# EAGLE design Power-board-new-version (EAGLE 9.1.0)
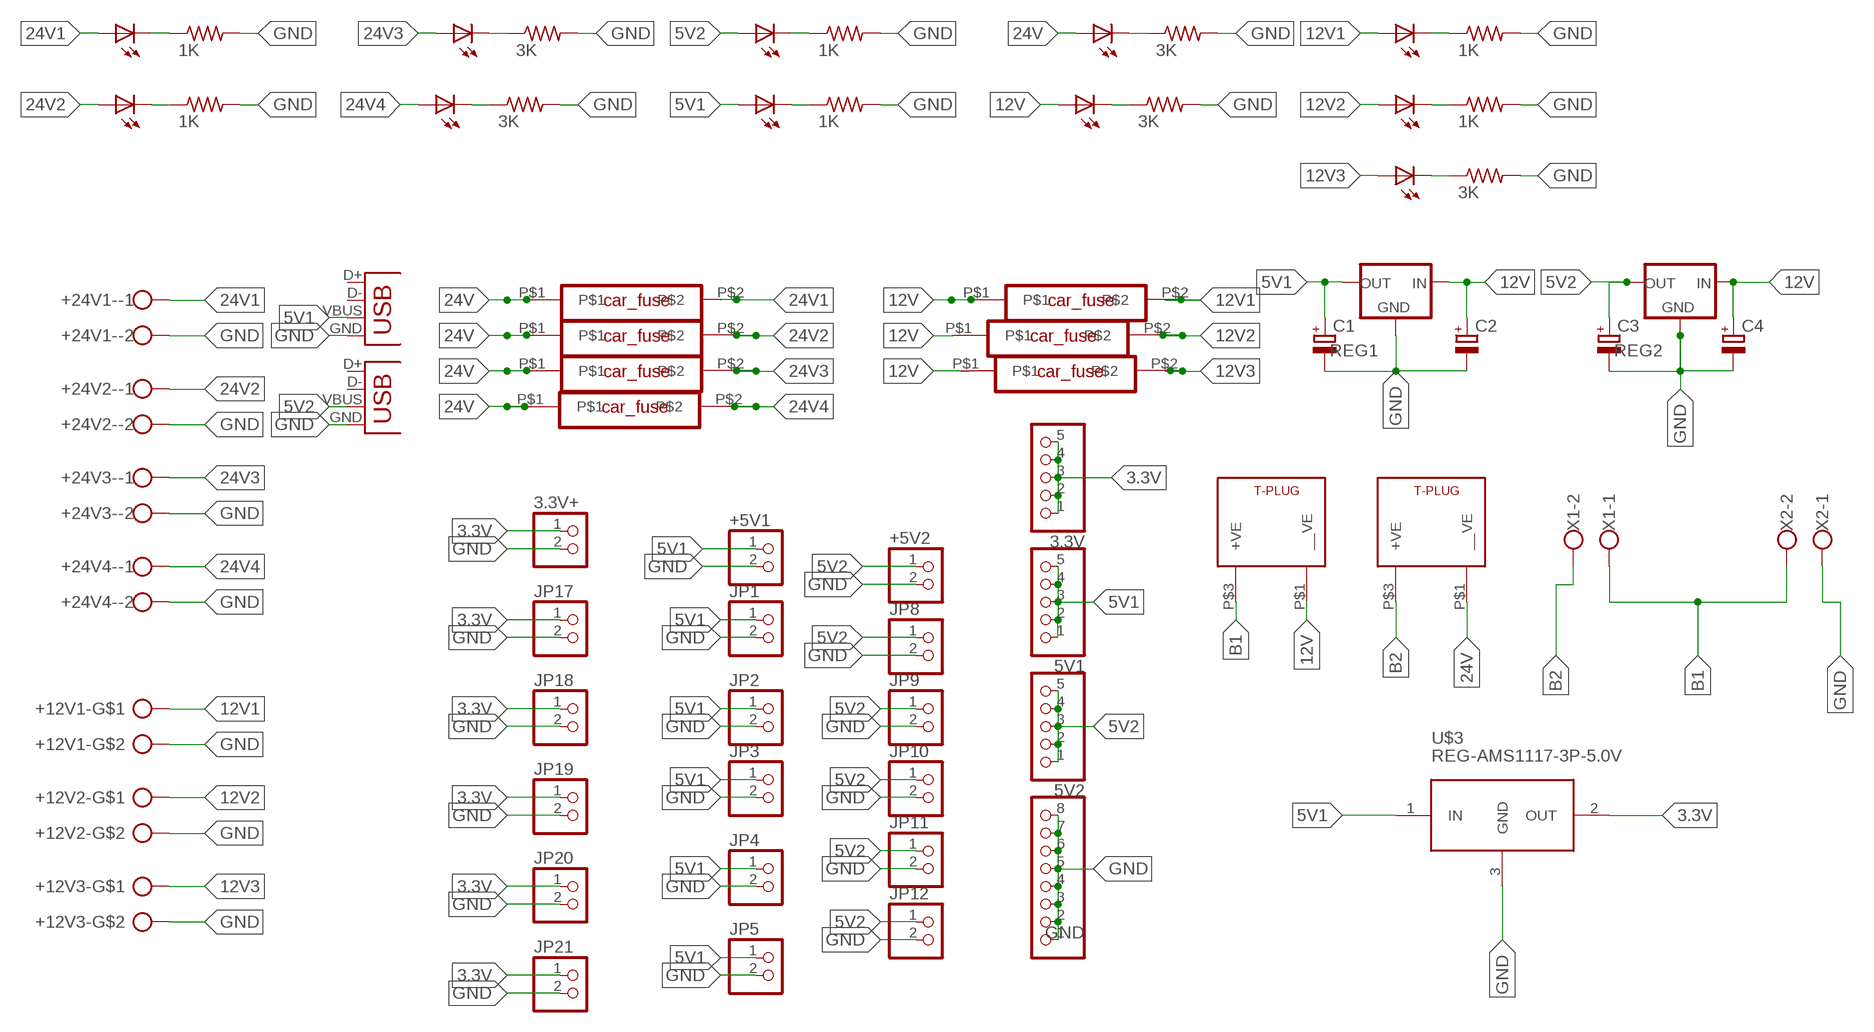
[diagram p0: schematic, sheet 1]

## Parts
1K  1K  RES-7  [0204/7]
1K1  1K  RES-7  [0204/7]
1K2  1K  RES-7  [0204/7]
3.3V  PINHD-1X5  [1X05]
3.3V+  PINHD-2_DATA  [1X02_DATA]
5V1  PINHD-1X5  [1X05]
5V2  PINHD-1X5  [1X05]
+5V1  PINHD-2_DATA  [1X02_DATA]
+5V2  PINHD-2_DATA  [1X02_DATA]
+12V1-  CON_PTR_2  [AK300/2]
+12V2-  CON_PTR_2  [AK300/2]
+12V3-  CON_PTR_2  [AK300/2]
+24V1-  ROSTA.POWER  [W239-302]
+24V2-  ROSTA.POWER  [W239-302]
+24V3-  ROSTA.POWER  [W239-302]
+24V4-  ROSTA.POWER  [W239-302]
C1  CAP_POL  [E3,5-8]
C2  CAP_POL  [E3,5-8]
C3  CAP_POL  [E3,5-8]
C4  CAP_POL  [E3,5-8]
GND  PINHD-1X8  [1X08]
JP1  PINHD-2_DATA  [1X02_DATA]
JP2  PINHD-2_DATA  [1X02_DATA]
JP3  PINHD-2_DATA  [1X02_DATA]
JP4  PINHD-2_DATA  [1X02_DATA]
JP5  PINHD-2_DATA  [1X02_DATA]
JP8  PINHD-2_DATA  [1X02_DATA]
JP9  PINHD-2_DATA  [1X02_DATA]
JP10  PINHD-2_DATA  [1X02_DATA]
JP11  PINHD-2_DATA  [1X02_DATA]
JP12  PINHD-2_DATA  [1X02_DATA]
JP17  PINHD-2_DATA  [1X02_DATA]
JP18  PINHD-2_DATA  [1X02_DATA]
JP19  PINHD-2_DATA  [1X02_DATA]
JP20  PINHD-2_DATA  [1X02_DATA]
JP21  PINHD-2_DATA  [1X02_DATA]
REG1  78XX-METAL  [TO3-79]
REG2  78XX-METAL  [TO3-79]
U$1  LED5V2  LED3MM  [LED3MM]
U$2  LED5V1  LED3MM  [LED3MM]
U$3  REG-AMS1117-3P-5.0V  [REG-AMS1117-3P]
U$4  LED24V  LED3MM  [LED3MM]
U$5  T_CONNECTOR  [T-PLUG]
U$6  T_CONNECTOR  [T-PLUG]
U$7  1K  RES-7  [0204/7]
U$8  3K  RES-7  [0204/7]
U$9  3K  RES-7  [0204/7]
U$10  CAR_FUSE  [CAR_FUSE]
U$11  CAR_FUSE  [CAR_FUSE]
U$12  CAR_FUSE  [CAR_FUSE]
U$13  CAR_FUSE  [CAR_FUSE]
U$14  CAR_FUSE  [CAR_FUSE]
U$15  CAR_FUSE  [CAR_FUSE]
U$16  CAR_FUSE  [CAR_FUSE]
U$18  LED5V2  LED3MM  [LED3MM]
U$19  LED5V1  LED3MM  [LED3MM]
U$20  LED24V  LED3MM  [LED3MM]
U$21  LED12V  LED3MM  [LED3MM]
U$22  1K  RES-7  [0204/7]
U$23  3K  RES-7  [0204/7]
U$24  3K  RES-7  [0204/7]
U$25  LED5V2  LED3MM  [LED3MM]
U$26  LED5V1  LED3MM  [LED3MM]
U$27  LED24V  LED3MM  [LED3MM]
U$28  LED24V  LED3MM  [LED3MM]
U$29  1K  RES-7  [0204/7]
U$31  3K  RES-7  [0204/7]
USB1  USB-A-H  [USB-A-H]
USB2  USB-A-H  [USB-A-H]
X1  ROSTA.POWER  [W239-302]
X2  ROSTA.POWER  [W239-302]

## Nets
3.3V: 3.3V+.1 3.3V.1 3.3V.2 3.3V.3 3.3V.4 3.3V.5 JP17.1 JP18.1 JP19.1 JP20.1 JP21.1 U$3.2(OUT)
5V1: 5V1.1 5V1.2 5V1.3 5V1.4 5V1.5 +5V1.1 C1.+ JP1.1 JP2.1 JP3.1 JP4.1 JP5.1 REG1.1(OUT) U$2.A U$3.1(IN) USB1.VBUS
5V2: 5V2.1 5V2.2 5V2.3 5V2.4 5V2.5 +5V2.1 C3.+ JP8.1 JP9.1 JP10.1 JP11.1 JP12.1 REG2.1(OUT) U$1.A USB2.VBUS
12V: C2.+ C4.+ REG1.3(IN) REG2.3(IN) U$5.P$1(__VE) U$14.P$1 U$15.P$1 U$16.P$1 U$28.A
12V1: +12V1-.1 U$14.P$2 U$25.A
12V2: +12V2-.1 U$15.P$2 U$26.A
12V3: +12V3-.1 U$16.P$2 U$27.A
24V: U$4.A U$6.P$1(__VE) U$10.P$1 U$11.P$1 U$12.P$1 U$13.P$1
24V1: +24V1-.1 U$10.P$2 U$18.A
24V2: +24V2-.1 U$11.P$2 U$19.A
24V3: +24V3-.1 U$12.P$2 U$20.A
24V4: +24V4-.1 U$13.P$2 U$21.A
B1: U$5.P$3(+VE) X1.1 X2.2
B2: U$6.P$3(+VE) X1.2
GND: 1K1.2 1K2.2 1K.2 3.3V+.2 +5V1.2 +5V2.2 +12V1-.2 +12V2-.2 +12V3-.2 +24V1-.2 +24V2-.2 +24V3-.2 +24V4-.2 C1.- C2.- C3.- C4.- GND.1 GND.2 GND.3 GND.4 GND.5 GND.6 GND.7 GND.8 JP1.2 JP2.2 JP3.2 JP4.2 JP5.2 JP8.2 JP9.2 JP10.2 JP11.2 JP12.2 JP17.2 JP18.2 JP19.2 JP20.2 JP21.2 REG1.2(GND) REG2.2(GND) U$3.3(GND) U$7.2 U$8.2 U$9.2 U$22.2 U$23.2 U$24.2 U$29.2 U$31.2 USB1.GND USB2.GND X2.1
N$1: 1K1.1 U$18.K(C)
N$2: U$19.K(C) U$22.1
N$3: U$21.K(C) U$23.1
N$4: U$20.K(C) U$24.1
N$5: 1K2.1 U$25.K(C)
N$6: U$26.K(C) U$29.1
N$7: 1K.1 U$1.K(C)
N$8: U$2.K(C) U$7.1
N$9: U$8.1 U$28.K(C)
N$10: U$4.K(C) U$9.1
N$12: U$27.K(C) U$31.1
Unconnected: USB1.D+ USB1.D- USB2.D+ USB2.D-

## Library data of the parts
1K 1K1 1K2 U$7-U$9 U$22-U$24 U$29 U$31 = MIA_LIBRARY-2-2-2:RES-7
3.3V 5V1 5V2 = MIA_LIBRARY-2-2-2:PINHD-1X5: PIN HEADER
3.3V+ +5V1 +5V2 JP1-JP5 JP8-JP12 JP17-JP21 = MIA_LIBRARY-2-2-2:PINHD-2_DATA: PIN HEADER
+12V1- +12V2- +12V3- = MIA_LIBRARY-2-2-2:CON_PTR_2
+24V1- +24V2- +24V3- +24V4- X1 X2 = MIA_LIBRARY-2-2-2:ROSTA.POWER: WAGO SCREW CLAMP; OC_FARNELL: unknown; OC_NEWARK: unknown
C1-C4 = MIA_LIBRARY-2-2-2:CAP_POL
GND = MIA_LIBRARY-2-2-2:PINHD-1X8: PIN HEADER
REG1 REG2 = MIA_LIBRARY-2-2-2:78XX-METAL: VOLTAGE REGULATOR
U$1 U$2 U$4 U$18-U$21 U$25-U$28 = MIA_LIBRARY-2-2-2:LED3MM
U$3 = MIA_LIBRARY-2-2-2:REG-AMS1117-3P-*: Linear Regulator based on AMS1117 chip 3-pin version AMS1117 datasheet is available here: http://www.advanced-monolithic.com/pdf/ds1117.pdf Click here to find device on ebay.com <http://www.ebay.com/sch/ams1117+module> Note: There are many variants. Search for the proper version.
U$5 U$6 = MIA_LIBRARY-2-2-2:T_CONNECTOR
U$10-U$16 = MIA_LIBRARY-2-2-2:CAR_FUSE
USB1 USB2 = MIA_LIBRARY-2-2-2:USB: USB Connectors

## Board
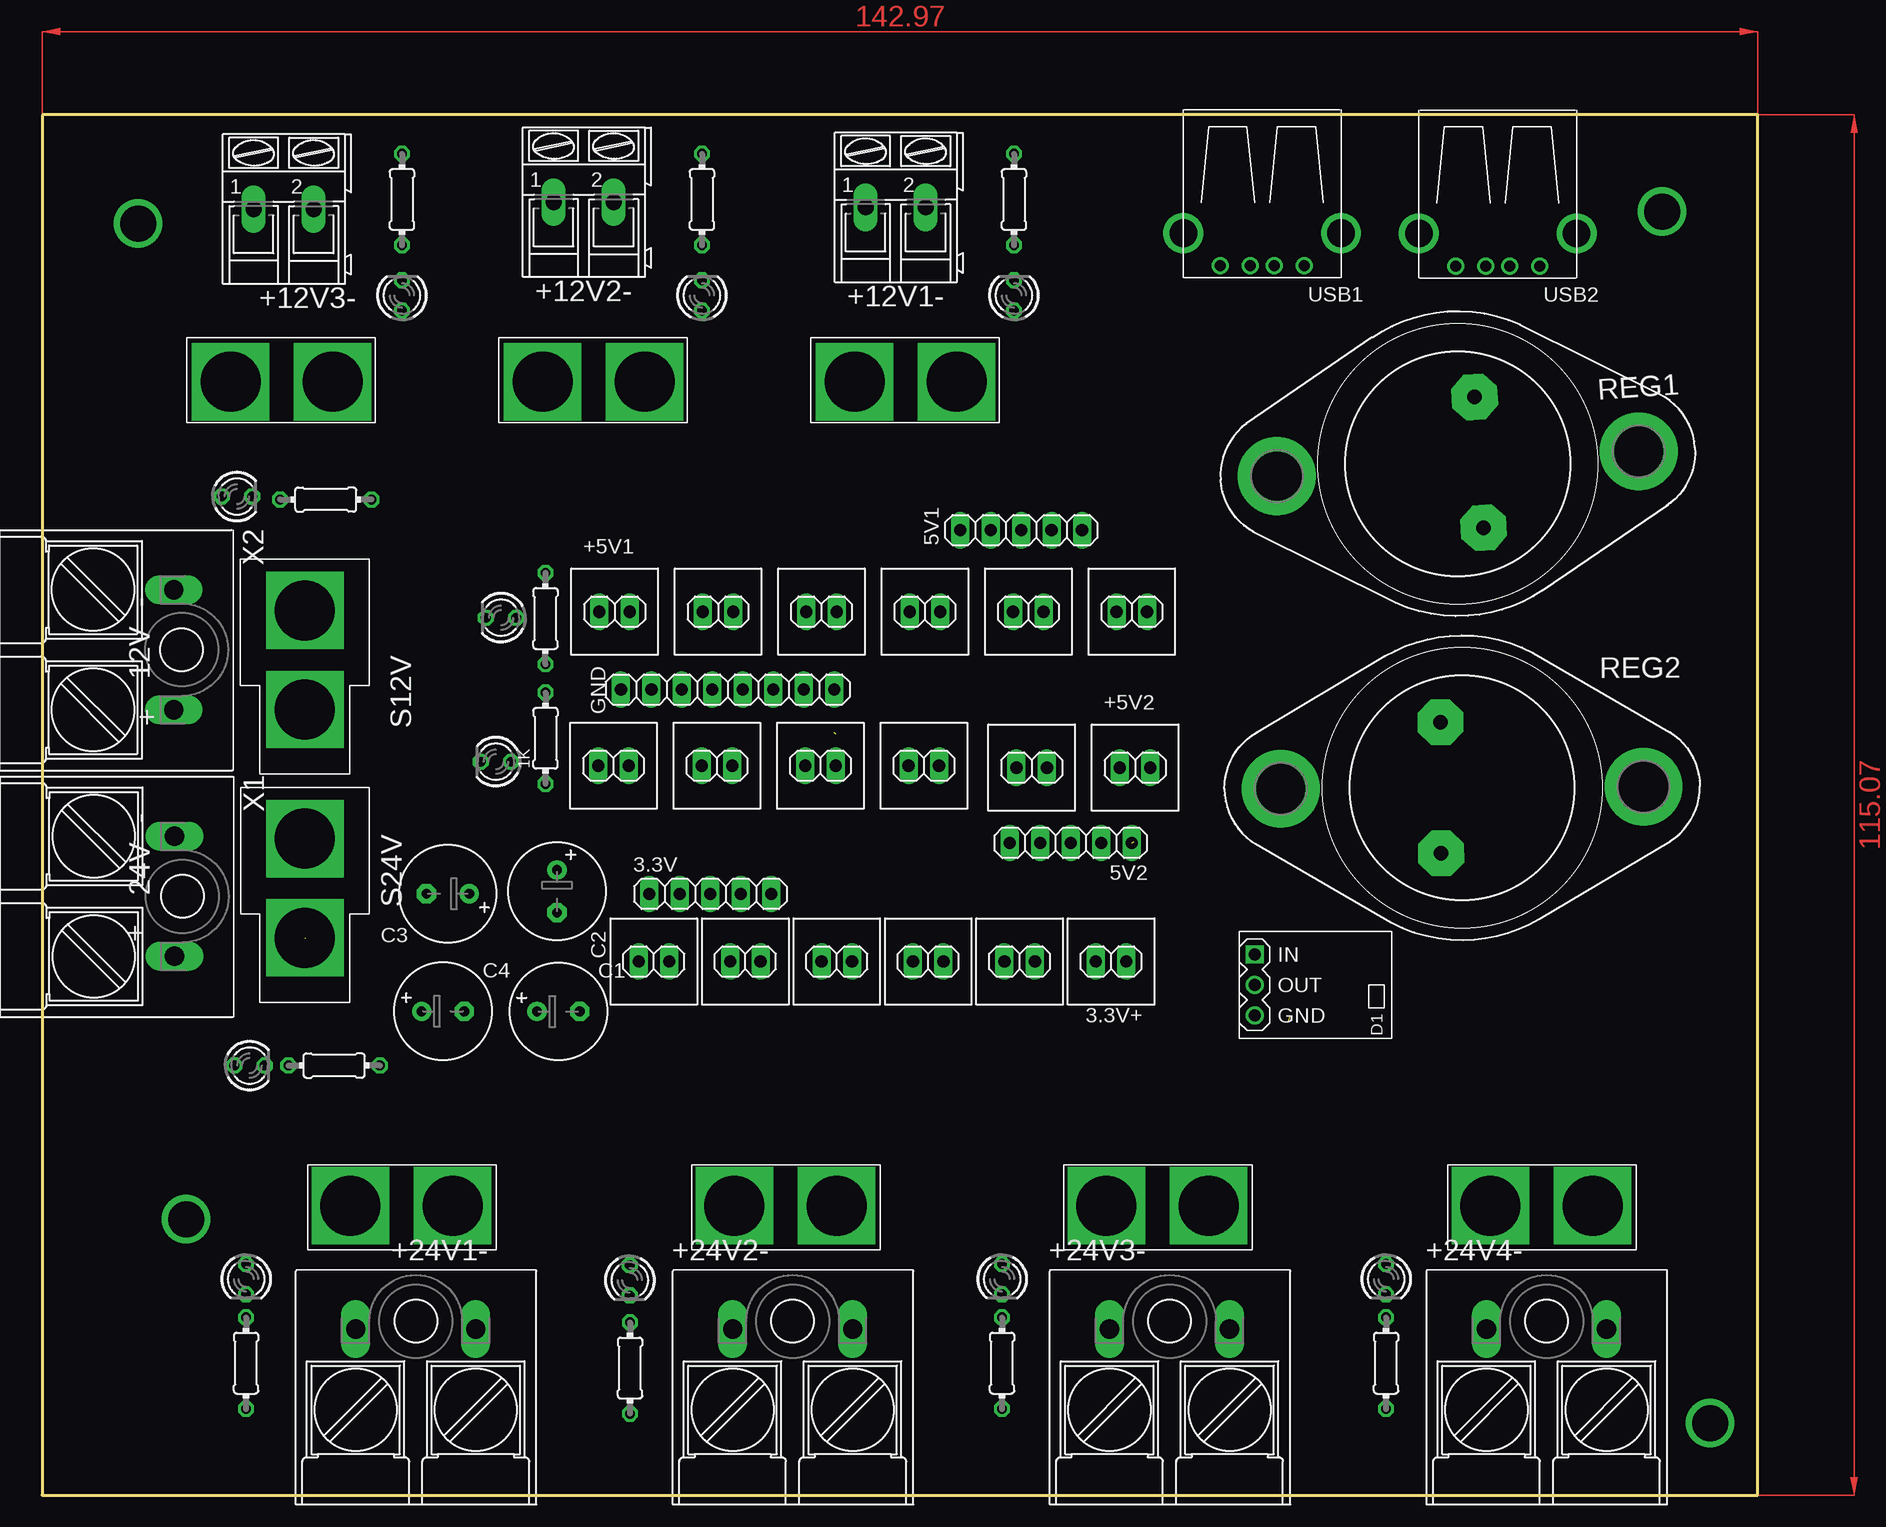
[diagram p1: board, top side]
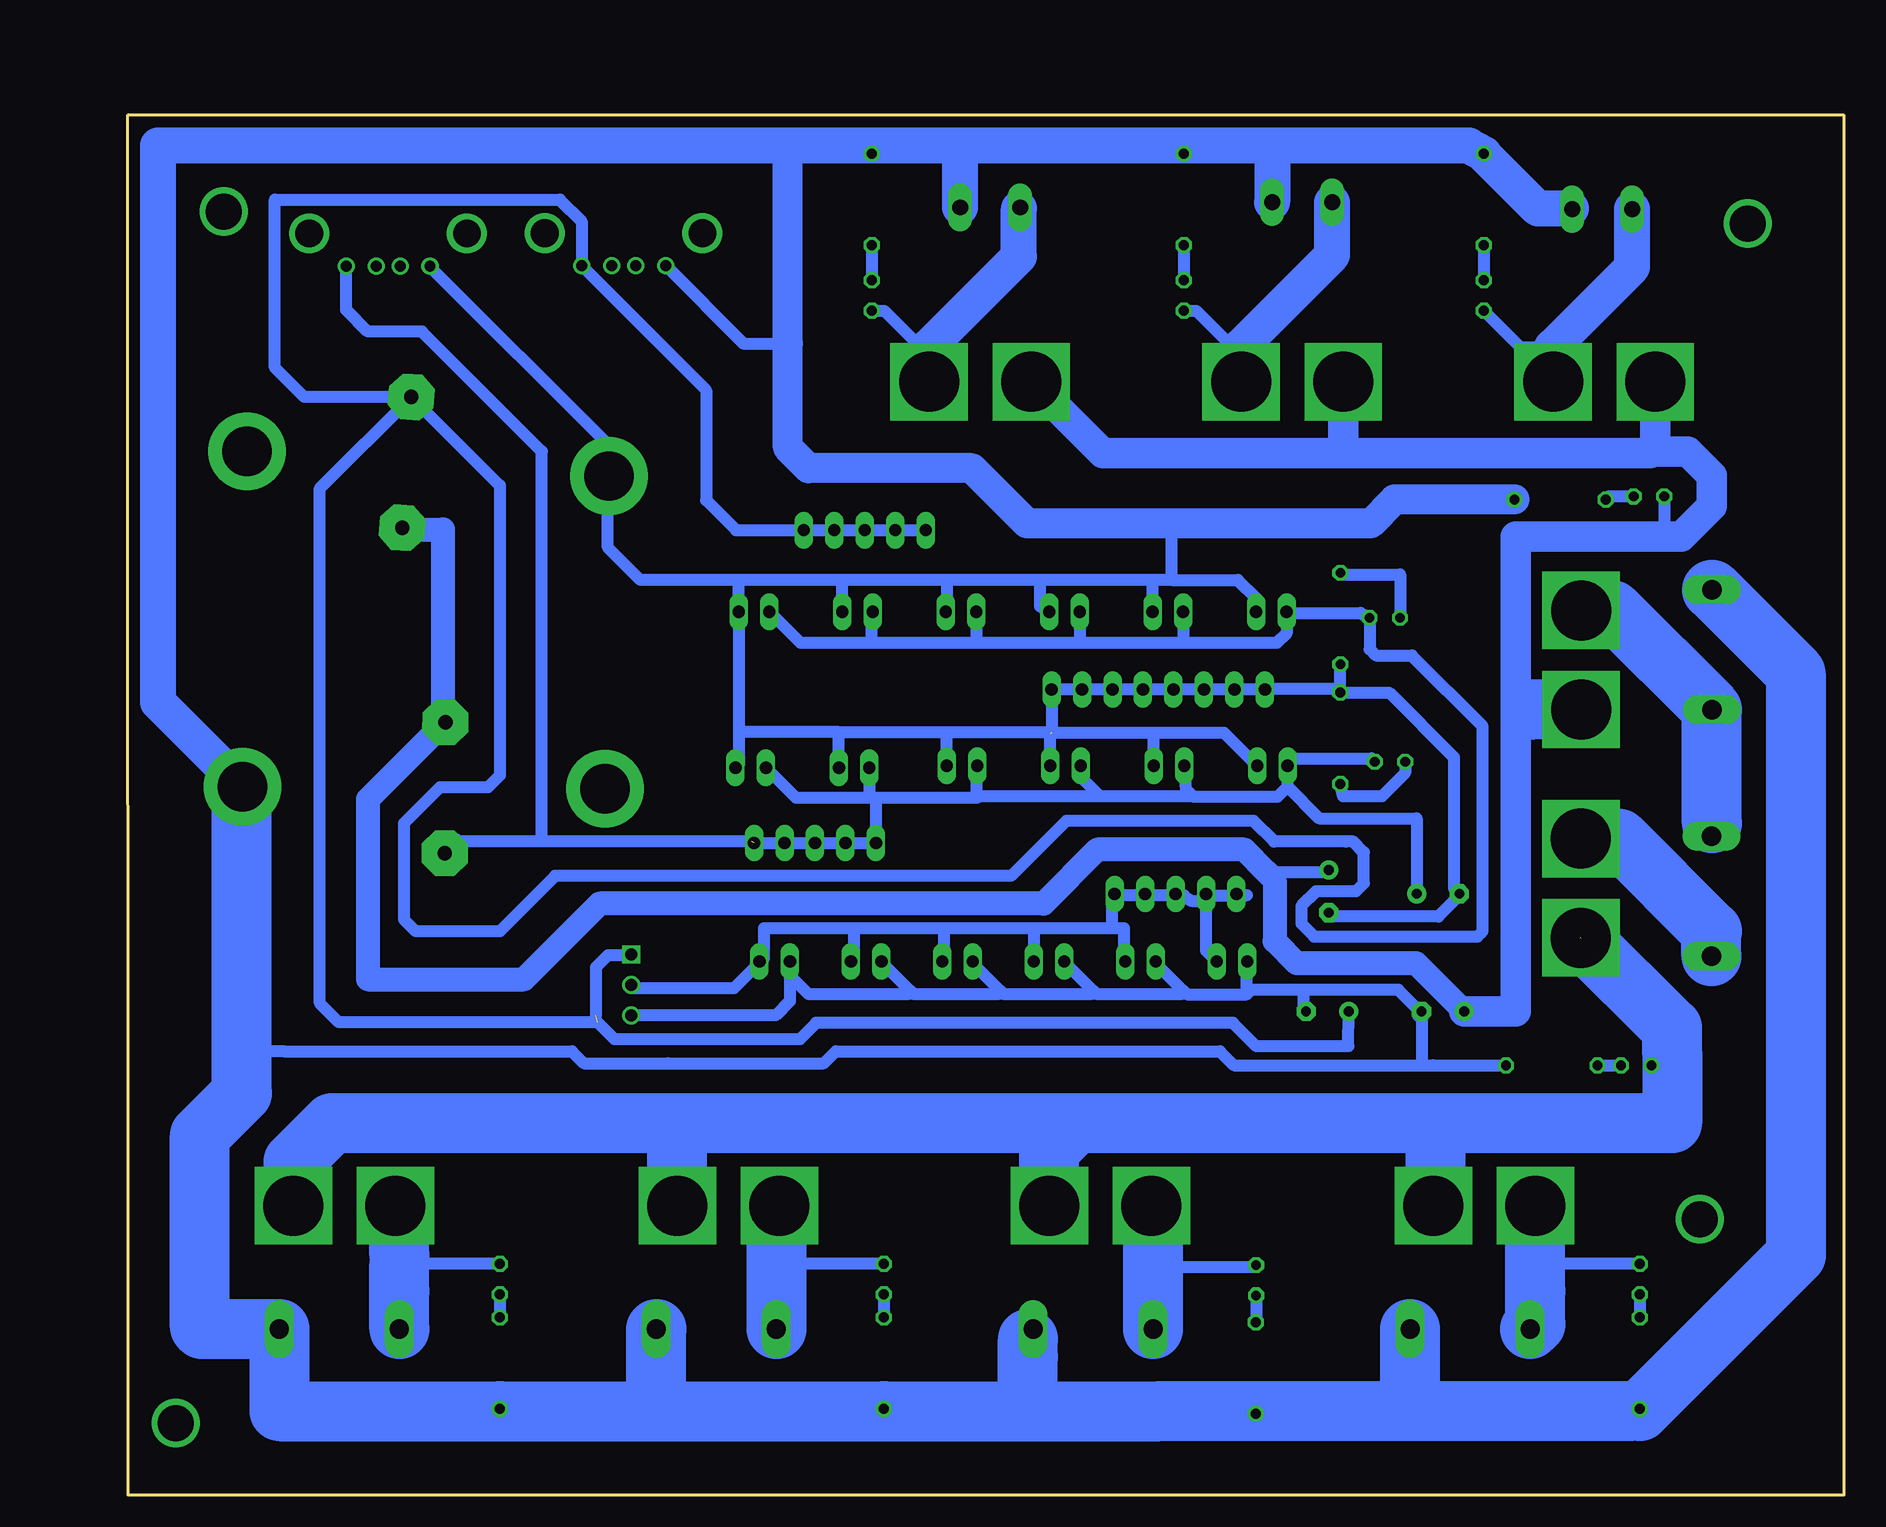
[diagram p2: board, bottom side, seen from below]

Size 142.99 x 115.07 mm. Coordinates in mm from the lower left corner, seen from the top.
Outline: 0,0 142.97,0 143,115.07 0.02,115.07 0,0
Copper layers (1*16): Top 0.035mm / dielectric 1.5mm / Bottom 0.035mm
Design rules "default *": minimum track width 1mm, minimum drill 0.35mm, track to track 0.5mm, track to pad 0.5mm, pad to pad 0.5mm, via to via 0.5mm, smd to smd 6mil, copper to edge 0.8mm, drill to drill 0.8mm, minimum pad ring 10mil, minimum via ring 8mil, stop-mask expansion 4mil, vias tented up to drill 0mil, thermal gap 10mil

### Footprints (pad centres in the part's own frame; a part is rotated, then mirrored left to right if it is on the bottom)
0204/7 = drill 0.813 octagon: 1 -3.81,0; 2 3.81,0
1X05 = drill 1.016 long: 1 -5.08,0; 2 -2.54,0; 3 0,0; 4 2.54,0; 5 5.08,0
1X02_DATA = drill 1.016 long: 1 -1.27,0; 2 1.27,0
AK300/2 = drill 1.321 long: 1 -2.515,0; 2 2.489,0
W239-302 = drill 1.6 long: 1 -5,5; 2 5,5
E3,5-8 = drill 0.813 pad 1.6: + -1.778,0 | drill 0.813 pad 1.6 octagon: - 1.778,0
1X08 = drill 1.016 long: 1 -8.89,0; 2 -6.35,0; 3 -3.81,0; 4 -1.27,0; 5 1.27,0; 6 3.81,0; 7 6.35,0; 8 8.89,0
TO3-79 = drill 1.194 pad 3.81 octagon: 1 -1.778,-5.461; 3 -1.778,5.461 | drill 4.115 pad 6.477: 2 15.113,0; 3@ -15.113,0
LED3MM = drill 0.813 octagon: A -1.27,0; K 1.27,0
REG-AMS1117-3P = drill 1 square: 1 -2.54,-5.08 | drill 1: 2 0,-5.08; 3 2.54,-5.08
T-PLUG = drill 5 pad 6.452 square: P$1 -2.73,-4; P$3 -11,-4
CAR_FUSE = drill 5 pad 6.452 square: P$1 2.794,-0.127; P$2 11.303,-0.127
USB-A-H = drill 0.914: D+ 2.718,-1.003; D- 2.718,1.003; GND 2.718,-3.493; VBUS 2.718,3.493 | drill 2.311: P$5 0,-6.566; P$6 0,6.566

### Placement (x,y rotation side)
1K  41.96,63.09 90 top
1K1  17,11 270 top
1K2  81,108 90 top
3.3V  55.69,50.11 0 top
3.3V+  89.09,44.48 180 top
5V1  81.59,80.43 0 top
5V2  85.73,54.36 180 top
+5V1  47.71,73.64 0 top
+5V2  91.09,60.64 0 top
+12V1-  71.15,107.34 0 top
+12V2-  45.15,107.77 0 top
+12V3-  20.15,107.2 0 top
+24V1-  31.14,8.83 0 top
+24V2-  62.55,8.83 0 top
+24V3-  93.96,8.83 0 top
+24V4-  125.37,8.83 0 top
C1  43.03,40.32 0 top
C2  42.91,50.33 270 top
C3  33.81,50.12 180 top
C4  33.41,40.33 0 top
GND  57.13,67.15 0 top
JP1  90.81,73.64 0 top
JP2  82.19,73.64 0 top
JP3  73.57,73.64 0 top
JP4  64.95,73.64 0 top
JP5  56.33,73.64 0 top
JP8  82.47,60.64 0 top
JP9  73.48,60.8 0 top
JP10  64.86,60.8 0 top
JP11  56.24,60.8 0 top
JP12  47.62,60.8 0 top
JP17  50.99,44.48 180 top
JP18  58.61,44.48 180 top
JP19  66.23,44.48 180 top
JP20  73.85,44.48 180 top
JP21  81.47,44.48 180 top
REG1  117.98,85.97 183.9 top
REG2  118.34,58.97 0.3 top
U$1  37.82,61.13 180 top
U$2  38.25,73.13 180 top
U$3  106.13,42.53 270 top
U$4  17.3,35.81 0 top
U$5  25.9,62.75 270 top
U$6  25.91,43.72 270 top
U$7  41.95,73.07 270 top
U$8  23.64,82.98 0 top
U$9  24.34,35.81 0 top
U$10  37,24 180 top
U$11  69,24 180 top
U$12  100,24 180 top
U$13  132,24 180 top
U$14  64.92,92.94 0 top
U$15  38.92,92.94 0 top
U$16  12.92,92.94 0 top
U$18  17,18 270 top
U$19  48.97,17.91 270 top
U$20  80,18 270 top
U$21  112,18 270 top
U$22  49,10.59 270 top
U$23  112,11 270 top
U$24  80,11 270 top
U$25  81,100 90 top
U$26  55,100 90 top
U$27  30,100 90 top
U$28  16.24,83.25 0 top
U$29  55,108 90 top
U$31  30,108 90 top
USB1  101.68,105.19 270 top
USB2  121.31,105.17 270 top
X1  6.03,49.92 270 top
X2  5.98,70.47 270 top

### Tracks (layer width: path | path; a pad name or v marks a point on that pad's centre or on a via)
3.3V
  Bottom 1: 50.5,50 53,50 3.3V.2 | 50.5,50 49.75,50 | 50.75,50 3.3V.1 50.5,50 | JP17.1 53.15,45.37 3.3V.2 | 3.3V.3 55.42,50.11 54.25,49.5 53.75,49.5 3.3V.2 | 55,50 55.5,50 | 55.5,50 57.5,50 58,50 | 56,50 3.3V.3 | 58,50 60.75,50 3.3V.5 61,49.88 61,47.25 | 58.5,50 3.3V.4 58,50 | JP18.1 60,44.5 60,47.25 61,47.25 | 67.5,47.25 JP19.1 | 61,47.25 67.5,47.25 | 75,47.25 75,44.5 JP20.1 | 67.5,47.25 75,47.25 | 82.5,47.25 82.5,44.5 JP21.1 | 75,47.25 82.5,47.25 | 82.5,47.25 90,47.25 90,44.75 3.3V+.1 90.5,44.25 92.5,42.25 100.77,42.25 U$3.2 | 55.5,50 3.3V.3
5V1  (1 unrouted)
  Bottom 1: C1.+ 41.28,37.41 48.96,37.41 50.92,39.37 85.63,39.37 87,38 102.43,38 103.84,39.41 125.41,39.41 127,41 127,83.92 REG1.1 | U$2.A 40.28,73.53 46.24,73.53 +5V1.1 46.44,71.83 47.24,71.03 54.99,71.03 | 72.24,73.53 JP3.1 72.3,71.34 71.99,71.03 | 30.1,64.1 30.1,47 30.55,46.55 44.13,46.55 45.21,47.63 45.21,49.11 43.98,50.33 40.67,50.33 40,51 40,53.59 40.88,54.46 41.46,54.46 | U$3.1 101.12,45 103,45 104,44 104,40 | 112,84.16 REG1.1 | 112,63 112,60 113,59 117,59 120,56 120,55 | REG1.1 128.29,91.54 130.75,94 130.75,108 107,108 105.17,106.17 USB1.VBUS 94.8,92.1 94.8,82.92 92.31,80.43 5V1.5 5V1.4 5V1.3 5V1.2 5V1.1 | 54.99,71.03 63.99,71.03 | 63.99,71.03 71.99,71.03 | 71.99,71.03 80.99,71.03 | 80.99,71.03 86.93,71.03 JP1.1 | 80.99,71.03 80.99,73.57 JP2.1 | JP4.1 63.68,71.34 63.99,71.03 | JP5.1 55.06,71.1 54.99,71.03
  Bottom 1.016: U$2.A 39.52,70.52 39,70 36,70 30.1,64.1 | 41.46,54.46 47.46,54.46 49.21,56.21 64.79,56.21 69.38,51.62 107.38,51.62 112,47 119,47 120,48 120,55 | 112,84.16 112,63
5V2  (1 unrouted)
  Bottom 1: 108.5,54.5 108.5,87 118.5,97 123,97 124.8,98.8 USB2.VBUS | 72.24,58.24 72.24,58.11 80.99,58.11 | 72.24,58.24 72.24,60.78 JP9.1 | 54.2,58.24 54.18,58.22 47.19,58.22 46.35,59.05 | 54.2,58.24 54.8,58.84 JP11.1 | 61.99,58.28 61.95,58.24 54.2,58.24 | 61.99,58.28 63.36,59.65 JP10.1 | 72.24,58.24 62.03,58.24 61.99,58.28 | 108.5,54.5 91,54.5 90.92,54.58 | 108.5,54.5 112,54.5 112.5,54.5 | C3.+ 35.59,56.42 43.72,56.42 46.35,59.05 | 112.5,54.5 | 112.5,54.5 | 112.5,54.5 115.59,54.5 116.09,54 | 46.35,59.05 JP12.1 45.74,61.41 39.37,61.41 U$1.A | 5V2.1 5V2.2 5V2.3 5V2.4 5V2.5 80.65,57.77 80.99,58.11 | +5V2.1 87.3,58.11 80.99,58.11 | JP8.1 81.2,58.32 80.99,58.11
  Bottom 2.5: REG2.1 116.09,54 116,54
12V
  Bottom 1: 116.75,64.5 REG2.3 | C2.+ 43.1,51.92 48.08,51.92 | U$28.A 14.97,79.93 15,79.91 | 26.07,65.48 26.86,65.48 27.34,65
  Bottom 2: 116.75,64.5 116.75,80.5 119.98,80.5 REG1.3 | REG2.3 116.58,64.42 123,58 123,43 110,43 103.69,49.31 66.69,49.31 62.2,53.8 49.96,53.8 48.08,51.92 47.44,51.28 47.44,46.19 45.58,44.33 35.63,44.33 C4.+
  Bottom 2.54: C4.+ 27.34,40.33 27.34,65 27.34,79.91 15,79.91 13.53,79.91 11,82.43 11,85 13,87 16,87 | 42,86.88 61.77,86.88 U$14.P$1 | 42,86.88 16.12,86.88 16,87 | U$15.P$1 41.71,87.17 42,86.88 | U$16.P$1 15.71,87.29 16,87
  Bottom 5: U$5.P$1 26.07,65.48
12V1
  Bottom 1: 68.75,107.25 +12V1-.1 | 76.22,94.97 79.97,98.73 U$25.A
  Bottom 3: U$14.P$2 76.22,94.97 | 68.75,107.25 68.75,103.25 76.3,95.7
12V2
  Bottom 1: 50.22,94.97 53.98,98.73 U$26.A
  Bottom 3: U$15.P$2 50.22,94.97 | +12V2-.1 42.64,103.37 50.3,95.7
12V3
  Bottom 1: U$27.A 26.97,95.7 24.3,95.7
  Bottom 3: U$16.P$2 24.22,95.78 | +12V3-.1 17.63,102.37 24.22,95.78 | 24.3,95.7 24.22,95.78
24V  (1 unrouted)
  Bottom 1: U$4.A 14.84,37 14.3,37
  Bottom 5: 14.3,37 14.3,31 34,31 | 34,31 34.21,31 | 34,31 64,31 | 64,31 97,31 | 97,31 126,31 129.21,27.79 U$13.P$1 | 21.97,46.45 22.08,46.56 | 14.3,37 14.3,38.96 | U$12.P$1 97.21,30.79 97,31 | U$11.P$1 66.21,28.79 64,31 | 14.3,37 14.3,38.84 U$6.P$1 | U$10.P$1 34,24.33 34,31
24V1
  Bottom 1: U$18.A 25.7,19.27
  Bottom 5: +24V1-.1 25.7,14.27 25.7,17 25.7,19.27 U$10.P$2
24V2
  Bottom 1: U$19.A 49.15,19 57.55,19
  Bottom 5: +24V2-.1 57.55,19 57.55,23.98 U$11.P$2
24V3
  Bottom 1: U$20.A 88.69,19.27 88.96,19
  Bottom 5: U$12.P$2 88.96,23.86 88.96,19 +24V3-.1
24V4
  Bottom 1: U$21.A 120.37,19.27
  Bottom 5: +24V4-.1 120.37,17 120.37,19.27 | 120.37,20 120.37,23.8 U$13.P$2
B1
  Bottom 1: X1.1 11,54.95 11,56
  Bottom 5: X2.2 11.17,65.47 | X2.2 19.26,73.75 U$5.P$3 | X2.2 11.03,65.42 | X2.2 11,65.45 11,56
B2
  Bottom 5: X1.2 11.03,46.97 11,47 18.72,54.72 U$6.P$3
GND  (2 unrouted)
  Bottom 1: 30,111.75 U$31.2 | 22.75,107.25 +12V3-.2 | 32.12,50.01 C3.- 32.03,49.97 33.78,48.22 42.58,48.22 C2.- | 117.75,102.25 USB2.GND 117.82,102.41 103,87.59 103,85 | 103,85 REG1.2 | 66.99,76.28 66.99,74.11 JP4.2 | 74.74,76.28 74.74,73.78 JP3.2 | 66.99,76.28 74.74,76.28 | 74.74,76.28 82.24,76.28 83.49,76.28 | 83.49,76.28 89.99,76.28 90.38,76.28 92,76.28 | 48.89,61.72 JP12.2 51.66,63.57 57.23,63.57 | 74.74,61.03 JP9.2 74.75,63.27 74.45,63.57 | 1K.2 37.9,66.9 | 88,43.5 88,44.25 3.3V+.2 87.75,43.25 86.25,41.75 78,41.75 77.75,42 | 35.27,40.15 C4.- | 49.75,41.75 49.75,44.25 JP17.2 | 49.75,41.75 54.75,41.75 55,42 | 55,42 57.25,44.25 JP18.2 | 62.5,42 62.25,41.75 55.25,41.75 55,42 | 62.5,42 64.75,44.25 JP19.2 | 70.25,42 70,41.75 62.75,41.75 62.5,42 | 70.25,42 72.5,44.25 JP20.2 | 77.75,42 77.5,41.75 70.5,41.75 70.25,42 | 77.75,42 80,44.25 JP21.2 | 67.75,13.75 +24V2-.2 | 67.25,13.5 +24V2-.2 | 133.5,59 REG2.2 | 35.5,39.95 C4.- | 68,11.5 +24V2-.2 | U$22.2 49,7 | 130,37 133.5,37 | 106,37 105,36 98,36 | C4.- 35.33,40.33 37.12,42.12 45,42.12 | 45,42.12 49.38,42.12 49.75,41.75 | C1.- 45,40.51 45,42.12 | 52,37 50.84,35.84 35,35.83 | 35,35.83 34.24,35.83 28.17,35.83 U$9.2 | C4.- 35.19,36.02 35,35.83 | 92,76.28 100.28,76.28 103,79 103,85 | USB1.GND 91.72,96 88,96 | U$29.2 55,112.5 | U$24.2 80,7 | U$23.2 112,7 | 1K2.2 80.69,112.12 80.69,112.5 | 17,7 1K1.2 17.19,7 17.81,7 | U$7.2 1K.2 | 92.08,63.59 JP1.2 92.08,76.19 92,76.28 | +5V2.2 92.08,60.92 92.08,63.28 92.08,63.59 | 83.74,63.59 92.08,63.59 | 65.99,63.57 57.23,63.57 | JP11.2 57.51,63.29 57.48,63.32 57.23,63.57 | JP10.2 66.13,63.43 | 74.45,63.57 66.02,63.57 GND.8 GND.7 GND.6 GND.5 GND.4 GND.3 GND.2 GND.1 48.21,67.17 42.23,67.17 1K.2
  Bottom 1: 74.45,63.57 74.46,63.56 | JP8.2 83.74,63.59 | 74.45,63.57 83.72,63.57 83.74,63.59 | 57.51,76.28 55.99,76.28 50.49,76.28 48.98,74.77 +5V1.2 | 57.51,76.28 66.99,76.28 | JP2.2 83.46,76.25 83.49,76.28 | JP5.2 57.6,76.18 57.51,76.28
  Bottom 1.016: 57,7 56.75,6.75 | 52,37 84,37 85,36 98,36 | 130,37 106,37 | 3.3V+.2 87.82,41.18 89.01,39.99 U$3.3 | C3.- 32.5,50.59 32.5,61.5 37.9,66.9 | 55.99,76.28 55.99,81
  Bottom 2.5: U$8.2 37.45,82.98 39.44,81 55.99,81 56,81 68.06,81 72.66,85.6 86.28,85.6 88,87.32 88,96 88,112.5
  Bottom 3: 30,111.75 25.5,107.25 22.75,107.25 | 47.64,112.5 31.25,112.5 U$31.2 | REG2.2 140.5,66.1 140.5,112.5 88,112.5 83,112.5 81.69,112.5 80.69,112.5 76.5,112.5 74,112.5 | 47.64,112.5 +12V2-.2 | 47.64,112.5 | 47.64,112.5 | 47.64,112.5 55,112.5 74,112.5 | +12V1-.2 73.64,112.14 74,112.5
  Bottom 5: 133.5,59 133.5,37 133.5,33.5 137,30 137,14 136.83,13.83 +24V4-.2 130.37,7 112,7 99,7 | 36.14,7 49,7 57,7 68,7 | 68,7 68,11.5 68,13 | 36.14,7 +24V1-.2 | 17.81,7 36.14,7 | 99,7 80,7 68,7 | X2.1 4.02,68.51 4,65.98 4,20 17,7 | +24V3-.2 99,13.79 99,7
N$1
  Bottom 1: U$18.K 1K1.1
N$2
  Bottom 1.016: U$19.K 48.98,14.42 U$22.1
N$3
  Bottom 1: U$21.K U$23.1
N$4
  Bottom 1: U$20.K U$24.1
N$5
  Bottom 1: 1K2.1 U$25.K
N$6
  Bottom 1: U$29.1 U$26.K
N$7
  Bottom 1: U$1.K 36.55,60.2 38.48,58.27 41.73,58.27 1K.1
N$8
  Bottom 1: U$2.K 36.98,76.75 41.75,76.75 U$7.1
N$9
  Bottom 1: 17.5,83.26 U$28.K 19.57,83.25 U$8.1
N$10
  Bottom 1: U$9.1 U$4.K
N$11  (via drill 3)
  other vias: 139,6
N$12
  Bottom 1: U$31.1 U$27.K
N$13  (via drill 3)
  other vias: 8,106
N$14  (via drill 3)
  other vias: 12,23
N$15  (via drill 3)
  other vias: 135,107
(copper drawn outside any net)
  shapes: Top area x2

### Text on the board
tNames: - | S12V | 12V | + | - | 24V | S24V | +